# Altium schematic sheet MMA8452Q.SchDoc: MMA8452Q1 Accelerometer
size A4; Author: Sanju Prakash Kannioth; DrawnBy: Sanju Prakash Kannioth; Engineer: Sanju Prakash Kannioth; Revision: 1.0; SheetNumber: 8; SheetTotal: 10
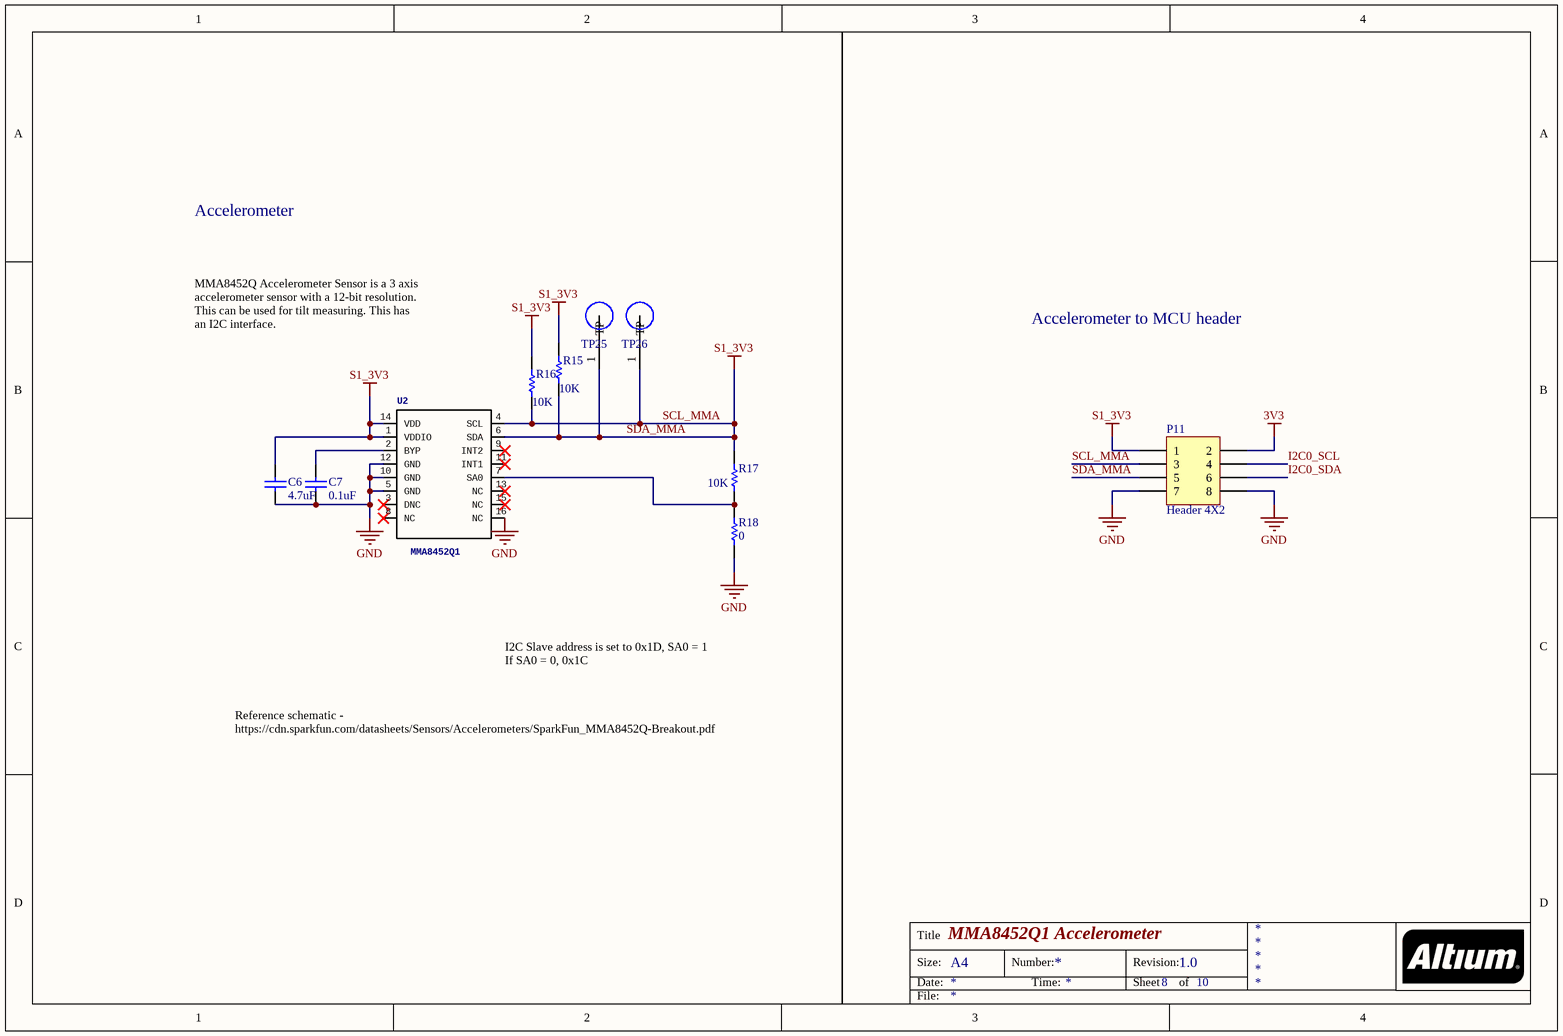
[diagram p0: MMA8452Q.SchDoc]

## Parts
C6  value 4.7uF  [1608[0603]]  (hidden comment: Cap)
C7  value 0.1uF  [1608[0603]]  (hidden comment: Cap)
P11  Header 4X2  [4-PIN]
R15  value 10K  [1608[0603]]  (hidden comment: Res1)
R16  value 10K  [1608[0603]]  (hidden comment: Res1)
R17  value 10K  [1608[0603]]  (hidden comment: Res1)
R18  value 0  [1608[0603]]  (hidden comment: Res1)
TP25  TP  [TP]  (value not drawn)
TP26  TP  [TP]  (value not drawn)
U2  MMA8452Q1  [MMA8452Q1]

## Nets
3V3: P11.2
GND: C6.1 C7.1 P11.7 P11.8 R18.1 U2.5(GND) U2.10(GND) U2.12(GND) U2.16(NC)
SCL_MMA: C6.2 P11.1 P11.3 P11.5 R15.1 R15.2 R16.1 R16.2 R17.2 TP25.1(TP) TP26.1(TP) U2.1(VDDIO) U2.4(SCL) U2.6(SDA) U2.14(VDD)  [also labelled S1_3V3, SDA_MMA]
I2C0_SCL: P11.4
I2C0_SDA: P11.6
NetC7_2: C7.2 U2.2(BYP)
NetR17_1: R17.1 R18.2 U2.7(SA0)

Not connected (* = marked no-connect by the designer): U2 3(DNC)* 8(NC)* 9(INT2)* 11(INT1)* 13(NC)* 15(NC)*

## Notes on the sheet
- Accelerometer
- MMA8452Q Accelerometer Sensor is a 3 axis accelerometer sensor with a 12-bit resolution. This can be used for tilt measuring. This has an I2C interface.
- Accelerometer to MCU header
- I2C Slave address is set to 0x1D, SA0 = 1
  If SA0 = 0, 0x1C
- Reference schematic - https://cdn.sparkfun.com/datasheets/Sensors/Accelerometers/SparkFun_MMA8452Q-Breakout.pdf
- Title
- Size:
- Date:
- A4
- Number:
- Time:
- Revision:
- Sheet
- of
- File:

## Library data of the parts
C6 = Cap: Capacitor; Manufacturer: Samsung Electro-Mechanics; Manufacturer Part Number: CL10B475KQ8NQNC; Digi-Key Part Number: 1276-2087-1-ND; DigiKeyURL: https://www.digikey.com/product-detail/en/samsung-electro-mechanics/CL10B475KQ8NQNC/1276-2087-1-ND/3890173
C7 = Cap: Capacitor; Manufacturer: Samsung Electro-Mechanics; Manufacturer Part Number: CL10B104KO8NNNC; Digi-Key Part Number: 1276-1005-1-ND; DigiKeyURL: https://www.digikey.com/product-detail/en/samsung-electro-mechanics/CL10B104KO8NNNC/1276-1005-1-ND/3889091
P11 = Header 4X2: Header, 4-Pin, Dual row; Manufacturer: TE Connectivity; Manufacturer Part Number: 5-146256-4; Digi-Key Part Number: A121467-ND; DigiKeyURL: https://www.digikey.com/product-detail/en/te-connectivity/5-146256-4/A121467-ND/2275818
R15-R17 = Res1: RES 10K OHM 1% 1/8W 0603; Manufacturer: Stackpole Electronics Inc; Manufacturer Part Number: RNCP0603FTD10K0; Digi-Key Part Number: RNCP0603FTD10K0CT-ND; DigiKeyURL: https://www.digikey.com/product-detail/en/stackpole-electronics-inc/RNCP0603FTD10K0/RNCP0603FTD10K0CT-ND/2240478
R18 = Res1: RES SMD 0 OHM JUMPER 1/10W 0603; Manufacturer: Yageo; Manufacturer Part Number: RC0603JR-070RL; Digi-Key Part Number: 311-0.0GRCT-ND; DigiKeyURL: https://www.digikey.com/product-detail/en/yageo/RC0603JR-070RL/311-0.0GRCT-ND/729622
TP25 TP26 = TP: PC TEST POINT MINIATURE; Manufacturer: Keystone Electronics; Manufacturer Part Number: 5019; Snapeda_Url: https://www.snapeda.com/parts/5019/Keystone%20Electronics/view-part/?ref=search&t=5019; DigiKeyURL: https://www.digikey.com/product-detail/en/keystone-electronics/5019/36-5019CT-ND/3907344?utm_source=snapeda&utm_medium=aggregator&utm_campaign=symbol; Digi-Key Part Number: 36-5019CT-ND
U2 = MMA8452Q: ACCELEROMETER 2-8G I2C 16QFN; Manufacturer: NXP USA Inc.; Manufacturer Part Number: MMA8452QR1; Digi-Key Part Number: MMA8452QR1CT-ND; DigiKeyURL: https://www.digikey.com/products/en/sensors-transducers/motion-sensors-accelerometers/515?k=MMA8452Q&k=&pkeyword=MMA8452Q&sv=0&pv7=2&sf=0&FV=ffe00203&quantity=&ColumnSort=0&page=1&stock=1&datasheet=1&pageSize=25; Snapeda_URL: https://www.snapeda.com/parts/MMA8452QR1/NXP%20USA/view-part/?ref=search&t=MMA8452QR1